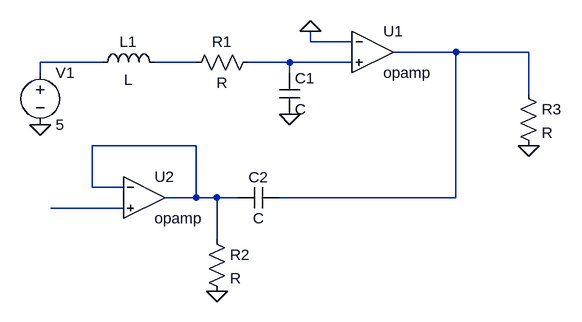
[diagram p0: schematic Piezer amplifier sim.asc]
Piezer amplifier sim.asc, the LTspice schematic file:
Version 4
SHEET 1 880 680
WIRE 432 96 432 80
WIRE 496 96 432 96
WIRE 656 112 560 112
WIRE 768 112 656 112
WIRE 112 128 16 128
WIRE 256 128 192 128
WIRE 400 128 336 128
WIRE 496 128 400 128
WIRE 16 144 16 128
WIRE 400 144 400 128
WIRE 768 176 768 112
WIRE 256 256 96 256
WIRE 96 320 96 256
WIRE 144 320 96 320
WIRE 256 336 256 256
WIRE 256 336 208 336
WIRE 288 336 256 336
WIRE 320 336 288 336
WIRE 656 336 656 112
WIRE 656 336 384 336
WIRE 144 352 32 352
WIRE 288 400 288 336
FLAG 16 224 0
FLAG 400 208 0
FLAG 432 80 0
FLAG 288 480 0
FLAG 768 256 0
SYMBOL voltage 16 128 R0
WINDOW 123 0 0 Left 0
WINDOW 39 0 0 Left 0
SYMATTR InstName V1
SYMATTR Value 5
SYMBOL ind 96 144 R270
WINDOW 0 32 56 VTop 2
WINDOW 3 5 56 VBottom 2
SYMATTR InstName L1
SYMBOL res 352 112 R90
WINDOW 0 0 56 VBottom 2
WINDOW 3 32 56 VTop 2
SYMATTR InstName R1
SYMBOL cap 384 144 R0
SYMATTR InstName C1
SYMBOL opamp 528 48 R0
SYMATTR InstName U1
SYMBOL cap 384 320 R90
WINDOW 0 0 32 VBottom 2
WINDOW 3 32 32 VTop 2
SYMATTR InstName C2
SYMBOL res 272 384 R0
SYMATTR InstName R2
SYMBOL opamp 176 272 R0
SYMATTR InstName U2
SYMBOL res 752 160 R0
SYMATTR InstName R3

The netlist it stands for:
* Piezer amplifier sim.asc
V1 N002 0 5
L1 N002 N003 L
R1 N004 N003 R
C1 N004 0 C
XU1 0 N004 N001 opamp Aol=100K GBW=10Meg  ; pins invin noninvin out
C2 N001 N005 C
R2 N005 0 R
XU2 N005 N006 N005 opamp Aol=100K GBW=10Meg  ; pins invin noninvin out
R3 N001 0 R
.backanno
.end